# EAGLE design RelayBoard (EAGLE 6.1)
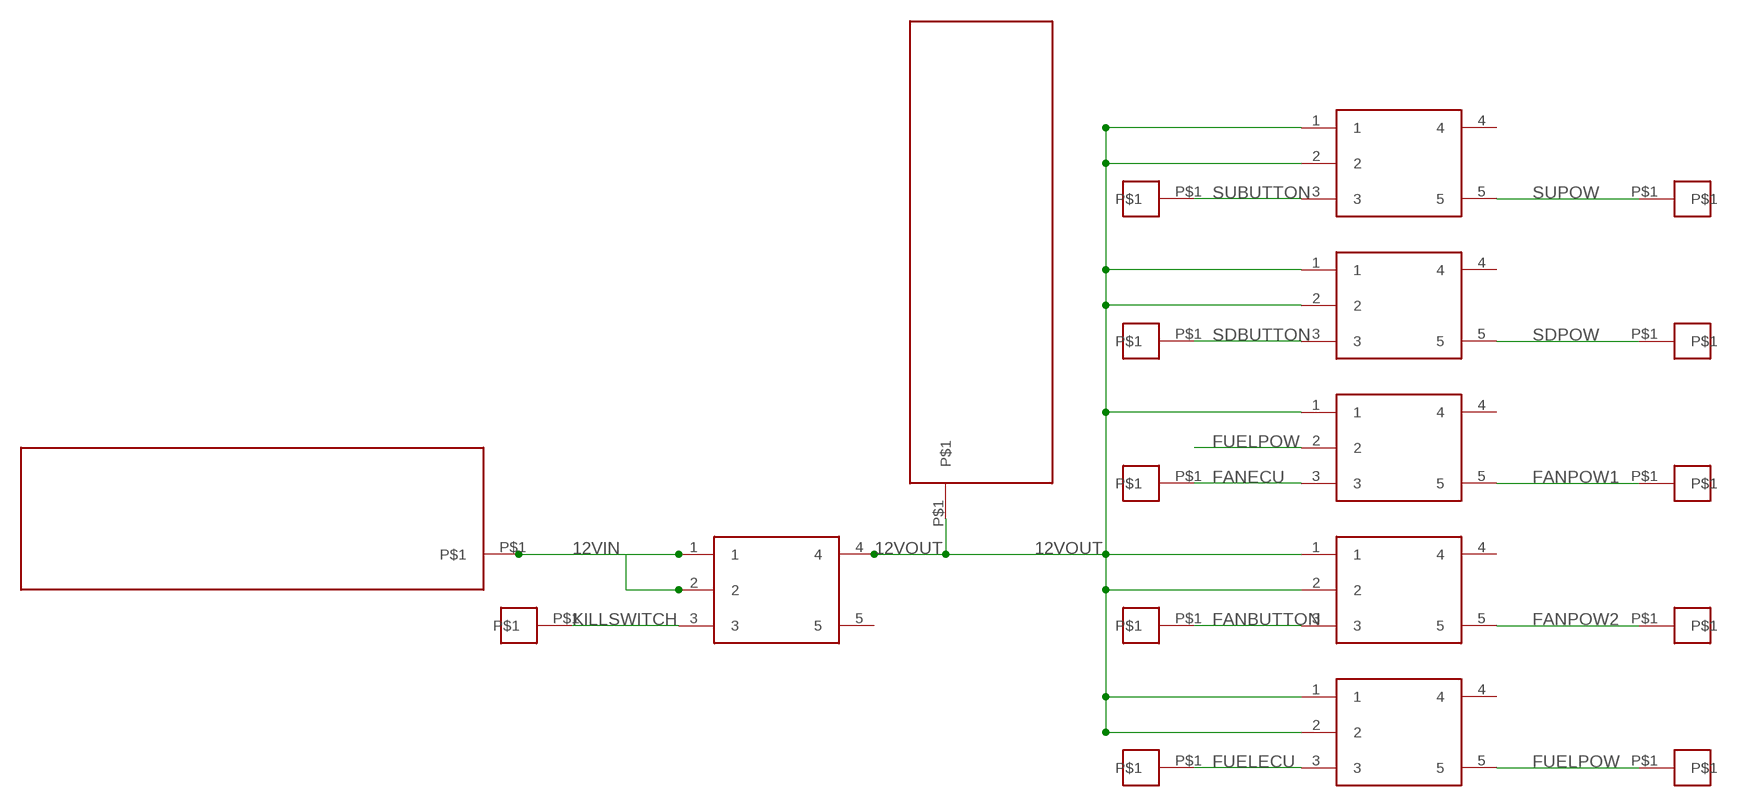
[diagram p0: schematic, sheet 1]

## Parts
U$1  RELAY  [RELAY]
U$2  RELAY  [RELAY]
U$3  RELAY  [RELAY]
U$4  RELAY  [RELAY]
U$5  RELAY  [RELAY]
U$6  RELAY  [RELAY]
U$7  PLUG2  [PLUG2]
U$8  PLUG2  [PLUG2]
U$9  OUTPUT  [OUTPUT]
U$10  OUTPUT  [OUTPUT]
U$11  OUTPUT  [OUTPUT]
U$12  OUTPUT  [OUTPUT]
U$13  OUTPUT  [OUTPUT]
U$14  OUTPUT  [OUTPUT]
U$15  OUTPUT  [OUTPUT]
U$16  OUTPUT  [OUTPUT]
U$17  OUTPUT  [OUTPUT]
U$18  OUTPUT  [OUTPUT]
U$19  OUTPUT  [OUTPUT]

## Nets
12VIN: U$6.1 U$6.2 U$7.P$1
12VOUT: U$1.1 U$1.2 U$2.1 U$2.2 U$3.1 U$4.1 U$4.2 U$5.1 U$5.2 U$6.4 U$8.P$1
FANBUTTON: U$4.3 U$11.P$1
FANECU: U$3.3 U$10.P$1
FANPOW1: U$3.5 U$16.P$1
FANPOW2: U$4.5 U$17.P$1
FUELECU: U$5.3 U$12.P$1
FUELPOW: U$3.2 U$5.5 U$18.P$1
KILLSWITCH: U$6.3 U$19.P$1
SDBUTTON: U$2.3 U$9.P$1
SDPOW: U$2.5 U$15.P$1
SUBUTTON: U$1.3 U$13.P$1
SUPOW: U$1.5 U$14.P$1
Unconnected: U$1.4 U$2.4 U$3.4 U$4.4 U$5.4 U$6.5

## Library data of the parts
U$1-U$6 = DashBoard:RELAY
U$7 U$8 = DashBoard:PLUG2
U$9-U$19 = DashBoard:OUTPUT

## Board
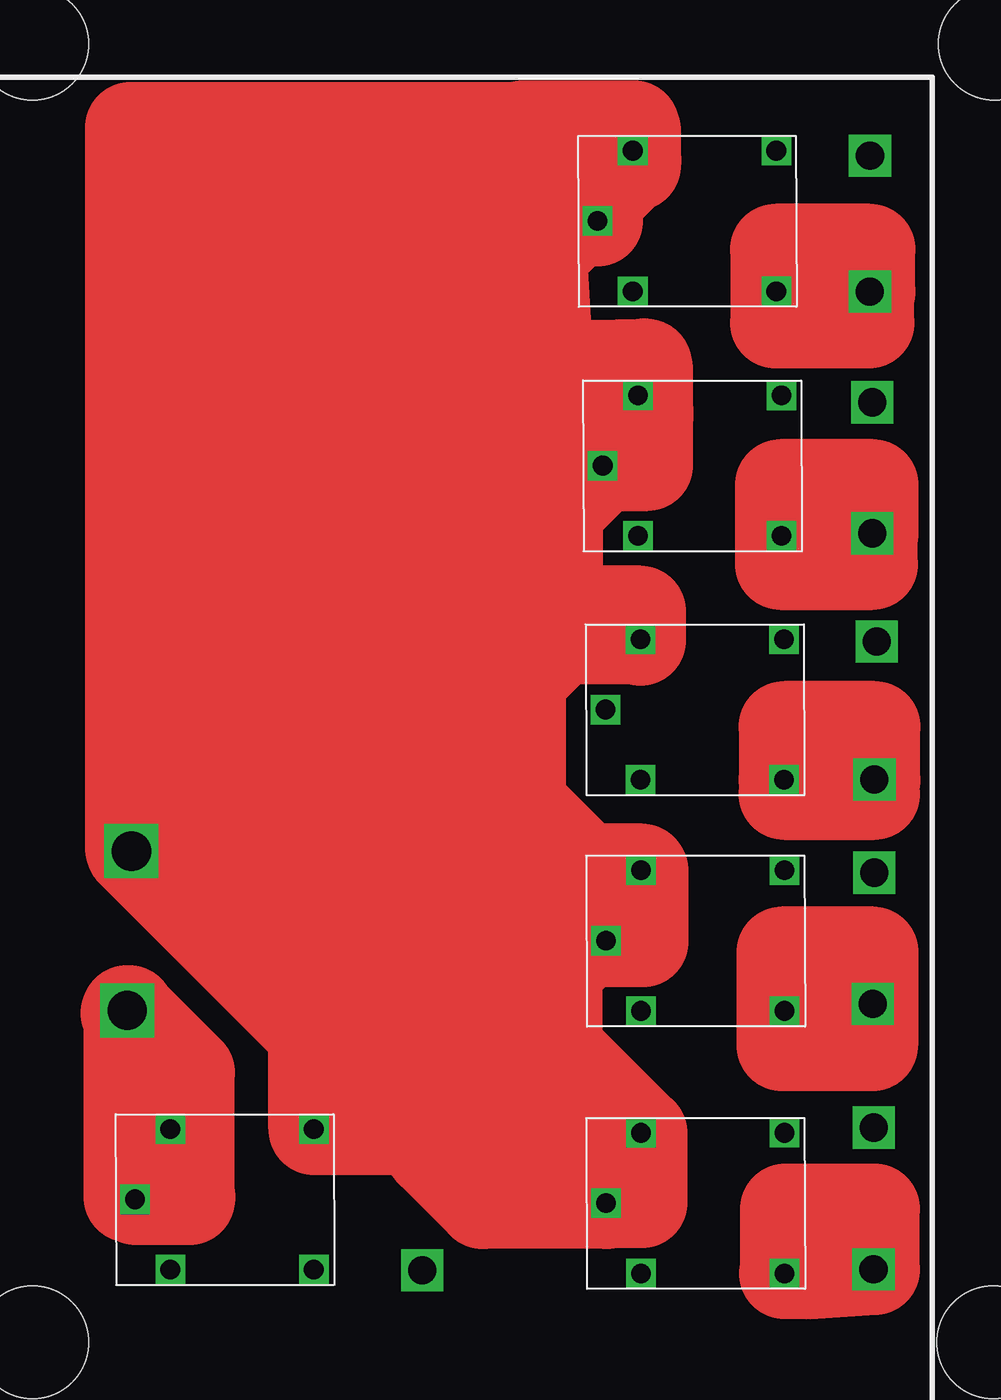
[diagram p1: board, top side]
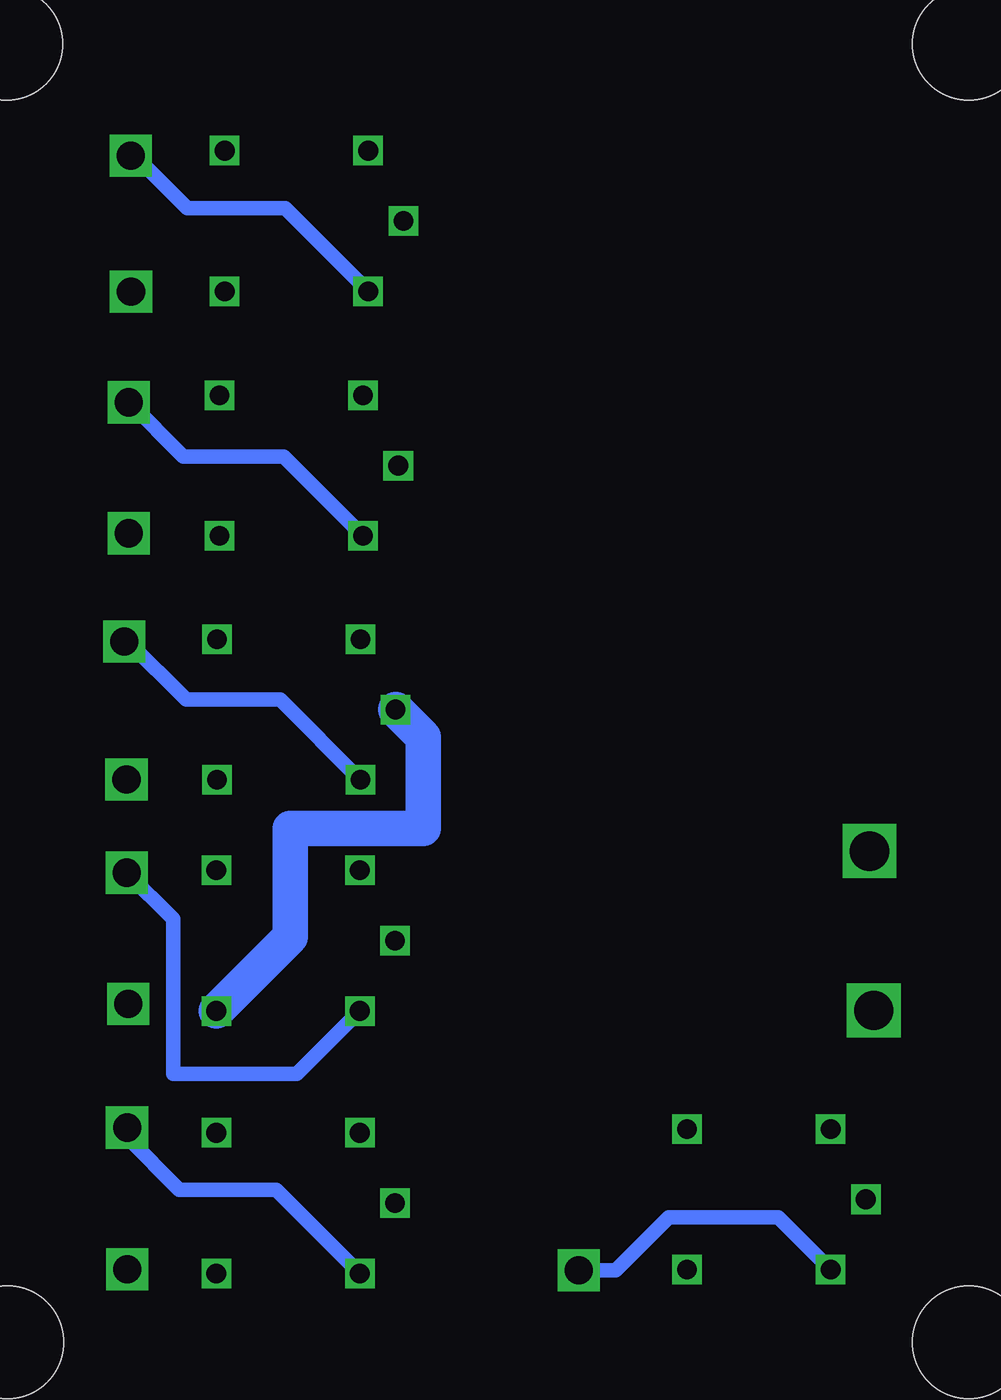
[diagram p2: board, bottom side, seen from below]

No outline drawn. Coordinates in mm, seen from the top.
Copper layers (1*16): Top 0.035mm / dielectric 1.5mm / Bottom 0.035mm
Design rules: minimum track width 10mil, minimum drill 24mil, track to track 8mil, track to pad 8mil, pad to pad 8mil, via to via 8mil, smd to smd 8mil, copper to edge 40mil, drill to drill 8mil, minimum pad ring 10mil, minimum via ring 8mil, stop-mask expansion 4mil, vias tented up to drill 0mil, thermal gap 10mil
Holes 8 mm at 73.2,97.1 4.8,97.1 4.8,4.8 73.1,4.8

### Footprints (pad centres in the part's own frame; a part is rotated, then mirrored left to right if it is on the bottom)
RELAY = drill 1.4 square: 1 2.5,5; 2 0,0; 3 2.5,-5; 4 12.7,5; 5 12.7,-5
PLUG2 = drill 2.8 square: P$1 0,0
OUTPUT = drill 2 square: P$1 0,0

### Placement (x,y rotation side)
U$1  44.97,84.51 0 top
U$2  45.33,67.12 0 top
U$3  45.52,49.78 0 top
U$4  45.56,14.69 0 top
U$5  45.56,33.35 0 top
U$6  12.1,14.96 0 top
U$7  11.54,28.39 0 top
U$8  11.83,39.72 0 top
U$9  64.48,71.62 0 top
U$10  64.81,54.62 0 top
U$11  64.6,20.06 0 top
U$12  64.62,38.18 0 top
U$13  64.33,89.15 0 top
U$14  64.32,79.48 0 top
U$15  64.49,62.31 0 top
U$16  64.64,44.81 0 top
U$17  64.58,9.98 0 top
U$18  64.52,28.86 0 top
U$19  32.5,9.92 0 top

### Tracks (layer width: path | path; a pad name or v marks a point on that pad's centre or on a via)
12VIN
  Top 6.452: U$7.P$1 14.6,25.33 U$6.1 12.1,17.46 U$6.2
12VOUT
  Top 6.452: 46.13,36.42 45.56,35.85 U$5.2 44.27,33.35 42.11,31.19 42.11,25.64 U$4.1 45.56,17.19 U$4.2 40.29,19.96 U$6.4 24.8,26.75 U$8.P$1 | 46.13,36.42 U$5.1 | 45.33,67.14 U$2.2 42.09,63.88 42.09,54.52 | 45.33,67.14 45.33,69.62 | 45.33,69.62 U$2.1 | U$1.1 44.97,87.01 U$1.2 40.81,84.46 41.61,71.46 43.45,69.62 45.33,69.62 | U$3.1 42.35,54.78 42.09,54.52 | 42.09,54.52 39.46,51.89 39.46,43.1 46.13,36.42 | 45.33,67.14 48.52,67.14 48.52,74.01
FANBUTTON
  Bottom 1.016: U$4.3 54.01,15.64 60.89,15.64 64.6,19.35 U$11.P$1
FANECU
  Bottom 1.016: U$3.3 53.72,50.48 60.4,50.48 64.54,54.62 U$10.P$1
FANPOW1
  Top 6.452: U$3.5 64.64,44.78 U$16.P$1
FANPOW2
  Top 6.452: U$4.5 59.85,9.68 U$17.P$1
FUELECU
  Bottom 1.016: U$5.3 52.54,23.87 61.32,23.87 61.32,34.88 U$12.P$1
FUELPOW
  Top 6.452: U$5.5 58.77,28.86 U$18.P$1
  Bottom 2.54: U$5.5 53.01,33.6 53.01,41.34 43.57,41.34 43.57,47.83 U$3.2
KILLSWITCH
  Bottom 1.016: U$6.3 18.32,13.68 26.1,13.68 29.86,9.92 U$19.P$1
N$1
  Top 6.452: 28.7,25.13 39.14,25.13 39.14,91.17 11.76,91.17 11.76,39.92 19.43,39.92 28.3,31.05 34.21,31.05 34.41,30.85 34.41,85.65 16.88,85.65 16.88,43.47 29.09,43.47 29.09,80.33 21.41,80.33 21.41,47.21 25.15,47.21 25.15,76.39 26.14,76.39
N$2
  Top 6.452: 24.56,40.31 24.56,37.95 31.06,37.95 31.06,34.79 30.27,34.79
N$3
  Top 6.452: 39.68,91.27 47.54,91.27
N$4
  Top 6.452: 47.65,90.94 47.65,88.47 47.59,88.47
N$5
  Top 6.452: 47.71,88.8 39.97,81.06 39.9,81.06
N$6
  Top 6.452: 41.01,75.09 41.87,74.23 48.43,74.33 47.93,71.4
N$7
  Top 6.452: 48.53,71.33 48.53,70.28 39.69,61.44
N$9
  Top 6.452: 48.46,70.08 48.46,74.16 48.26,74.36
N$10
  Top 6.452: 48.03,54.71 48.03,56.77 42.21,56.77
N$11
  Top 6.452: 48.13,38.33 48.13,38.44 41.92,38.44
N$12
  Top 6.452: 48.19,38.33 48.19,33.27 40.55,33.27
N$13
  Top 6.452: 48.11,19.66 48.11,14.72 45.64,14.72
N$14
  Top 6.452: 45.61,14.66 36.87,14.66 | 36.87,14.66 36.79,14.66 33.13,18.32 | 24.81,19.92 31.61,19.92 36.87,14.66
N$15
  Top 6.452: 64.54,62.28 64.54,65.76 57.96,65.76 57.96,60.1 64.49,60.1 64.49,65.42 63.73,65.42
N$16
  Top 6.452: 64.68,44.76 64.68,48.56 58.23,48.56 58.23,43.75 64.64,43.75 64.64,46.93 64.52,46.93
N$17
  Top 6.452: 64.54,28.86 64.54,32.54 58.06,32.54 58.06,25.89 64.52,25.89 64.52,28.87
N$18
  Top 6.452: 64.63,9.97 64.63,14.26 58.32,14.26 58.32,9.82 59.84,9.82
N$19
  Top 6.452: 12.17,14.95 15.96,14.95 15.96,23.97 11.73,28.2 11.45,28.2
N$20
  Top 6.452: 11.66,28.37 11.66,15.11 16.01,15.11
SDBUTTON
  Bottom 1.016: U$2.3 53.47,67.76 60.6,67.76 64.46,71.62 U$9.P$1
SDPOW
  Top 6.452: U$2.5 64.49,62.12 U$15.P$1
SUBUTTON
  Bottom 1.016: U$1.3 53.37,85.42 60.31,85.42 64.04,89.15 U$13.P$1
SUPOW
  Top 6.452: U$1.5 64.32,79.51 U$14.P$1 64.32,82.5 57.62,82.5 57.62,77.28 64.25,77.28 64.25,82.41 64.06,82.41

### Text on the board
tValues: SUBUTTON | SUPOWER | SDBUTTON | SDPOWER | FANECU | Dheer Mehrotra | RFR 2013 | FANPOWER | 12VOUT | FUELECU | 12VIN | FUELPOWER | FANBUTTON | KILLSWITCH | FANPOWER